# EAGLE design weather station - simple (EAGLE 9.0.1)
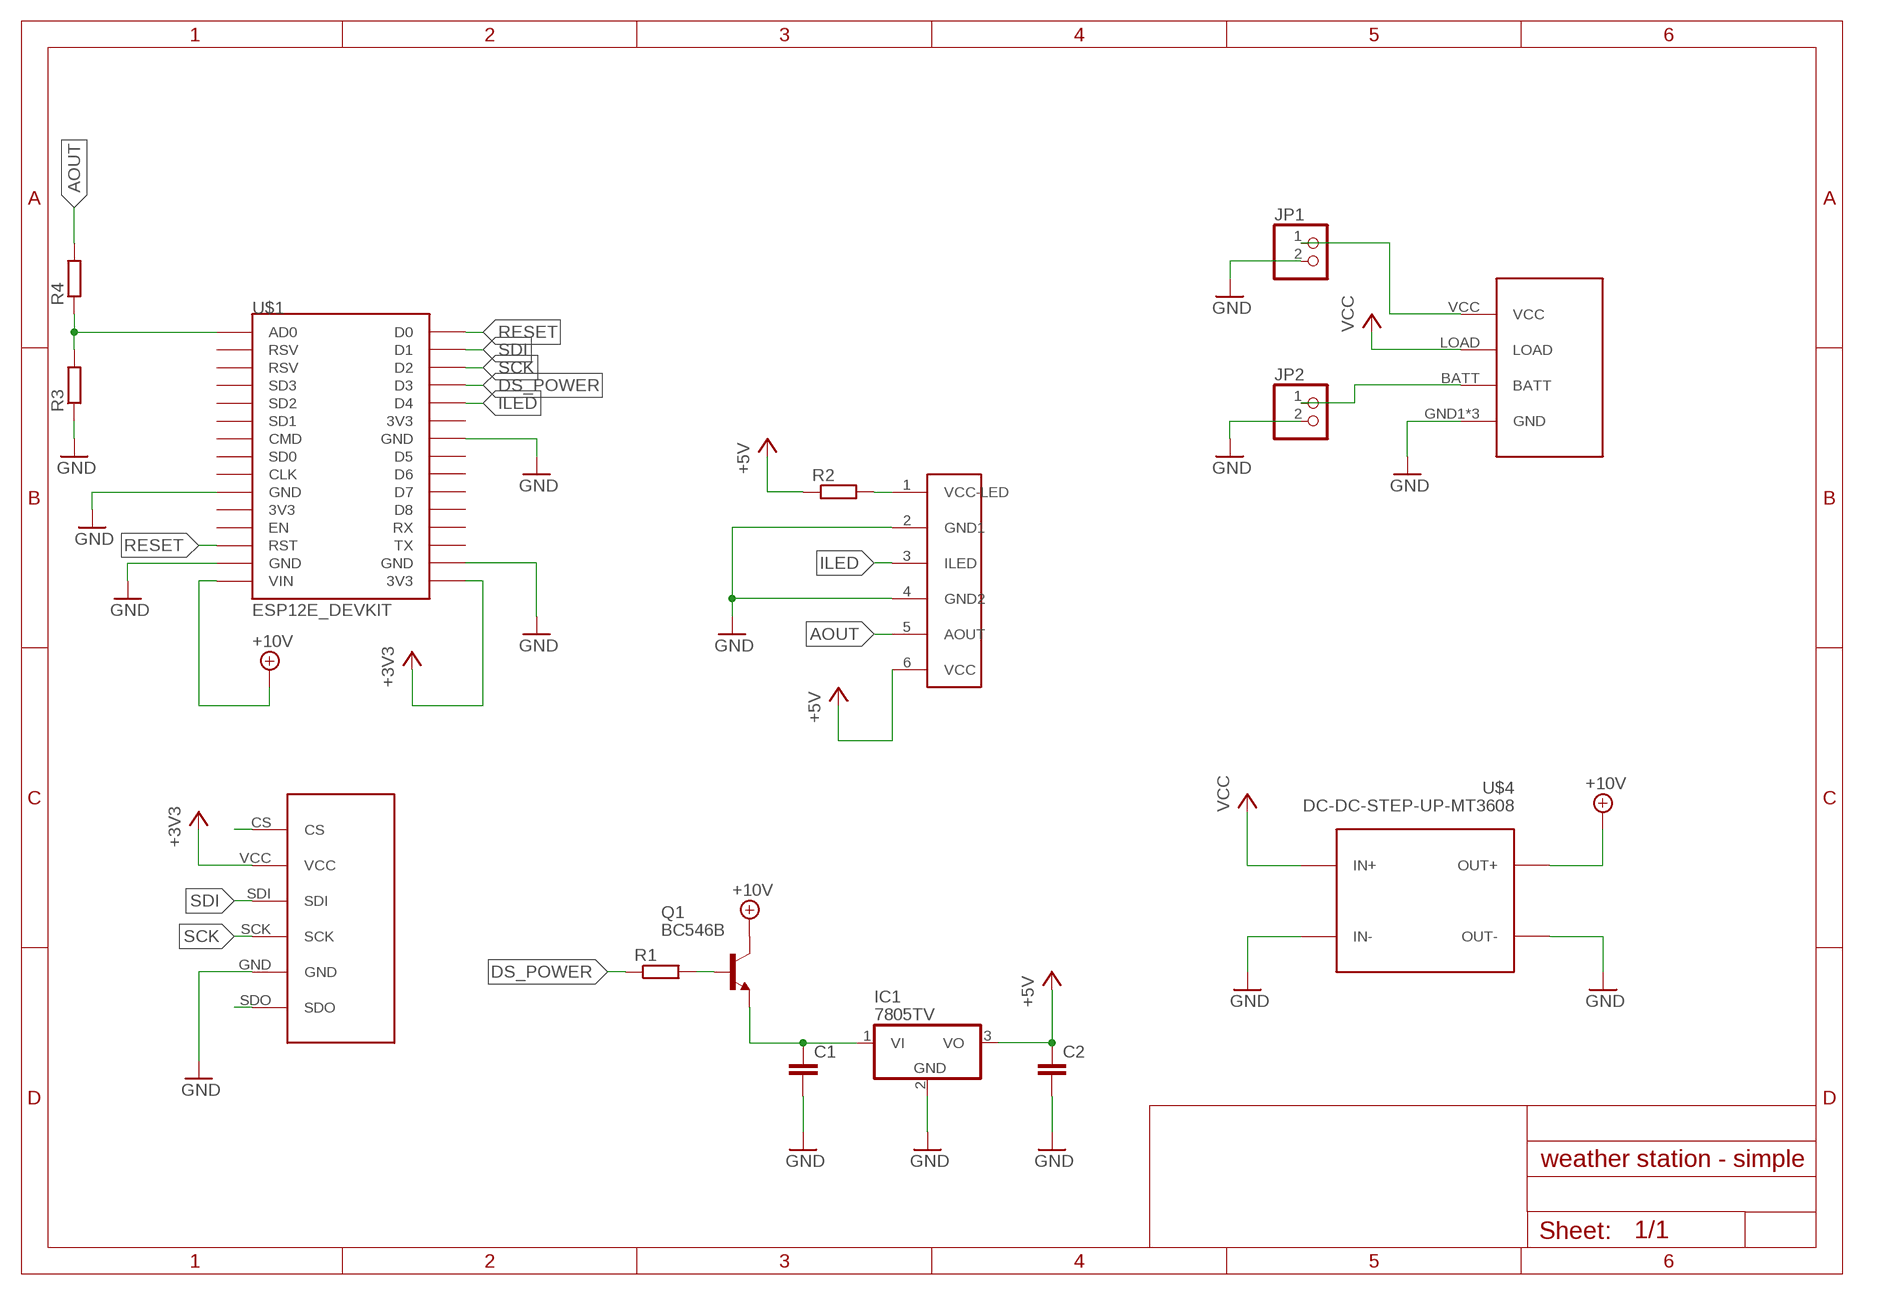
[diagram p0: schematic, sheet 1]

## Parts
C1  C-EU025-024X044  [C025-024X044]
C2  C-EU025-024X044  [C025-024X044]
IC1  7805TV  [TO220V]
JP1  PINHD-1X2  [1X02]
JP2  PINHD-1X2  [1X02]
Q1  BC546B  [TO92-EBC]
R1  R-EU_0207/10  [0207/10]
R2  R-EU_0207/10  [0207/10]
R3  R-EU_0207/10  [0207/10]
R4  R-EU_0207/10  [0207/10]
U$1  ESP12E_DEVKIT  [ESP12E_DEVKIT]
U$2  ADAFRUIT_SOLARCHARGER  [ADAFRUIT_SOLARCHARGER]
U$3  BME680_BLUEDOT  [1X06]
U$4  DC-DC-STEP-UP-MT3608  [DC-DC-STEP-UP-MT3608]
U$5  DUST_SENSOR  [DUST_SENSOR]

## Nets
+3V3: U$1.3V3@2(3V3) U$3.VCC
+5V: C2.1 IC1.3(VO) R2.1 U$5.6(VCC)
+10V: Q1.C U$1.VIN U$4.OUT+
AOUT: R4.2 U$5.5(AOUT)
DS_POWER: R1.1 U$1.D3
GND: C1.2 C2.2 IC1.2(GND) JP1.2 JP2.2 R3.1 U$1.GND@0(GND) U$1.GND@1(GND) U$1.GND@2(GND) U$1.GND@3(GND) U$2.GND1(GND) U$2.GND2(GND) U$2.GND3(GND) U$3.GND U$4.IN- U$4.OUT- U$5.2(GND1) U$5.4(GND2)
ILED: U$1.D4 U$5.3(ILED)
N$1: U$3.CS
N$2: JP2.1 U$2.BATT
N$3: JP1.1 U$2.VCC
N$4: C1.1 IC1.1(VI) Q1.E
N$5: Q1.B R1.2
N$6: R2.2 U$5.1(VCC-LED)
N$7: U$3.SDO
N$8: R3.2 R4.1 U$1.AD0
RESET: U$1.D0 U$1.RST
SCK: U$1.D2 U$3.SCK
SDI: U$1.D1 U$3.SDI
VCC: U$2.LOAD U$4.IN+
Unconnected: U$1.3V3@0(3V3) U$1.3V3@1(3V3) U$1.CLK U$1.CMD U$1.D5 U$1.D6 U$1.D7 U$1.D8 U$1.EN U$1.RSV@0(RSV) U$1.RSV@1(RSV) U$1.RX U$1.SD0 U$1.SD1 U$1.SD2 U$1.SD3 U$1.TX

## Library data of the parts
C1 C2 = rcl:C-EU: CAPACITOR, European symbol; SPICEPREFIX: C
IC1 = linear:78*: Positive VOLTAGE REGULATOR Source: http://cache.national.com/ds/LM/LM78L05.pdf http://www.fairchildsemi.com/ds/LM/LM7805.pdf
JP1 JP2 = pinhead:PINHD-1X2: PIN HEADER
Q1 = transistor-npn:BC546*: NPN Transistor
R1-R4 = rcl:R-EU_: RESISTOR, European symbol; SPICEPREFIX: R
U$1 = ESP12E_DEVKIT:ESP12E_DEVKIT: ESP12E DEVKIT BOARD
U$2 = ADAFRUIT-SOLARCHARGER:ADAFRUIT_SOLARCHARGER
U$3 = bme-680:BME680_BLUEDOT
U$4 = diy-modules:DC-DC-STEP-UP-MT3608: DC/DC Step-Up Regulator based on MT3608 chip MT3608 datasheet available here: https://www.olimex.com/Products/Breadboarding/BB-PWR-3608/resources/MT3608.pdf Click here to find device on ebay.com <http://www.ebay.com/sch/mt3608+module>
U$5 = dust-sensor:DUST_SENSOR

## Board
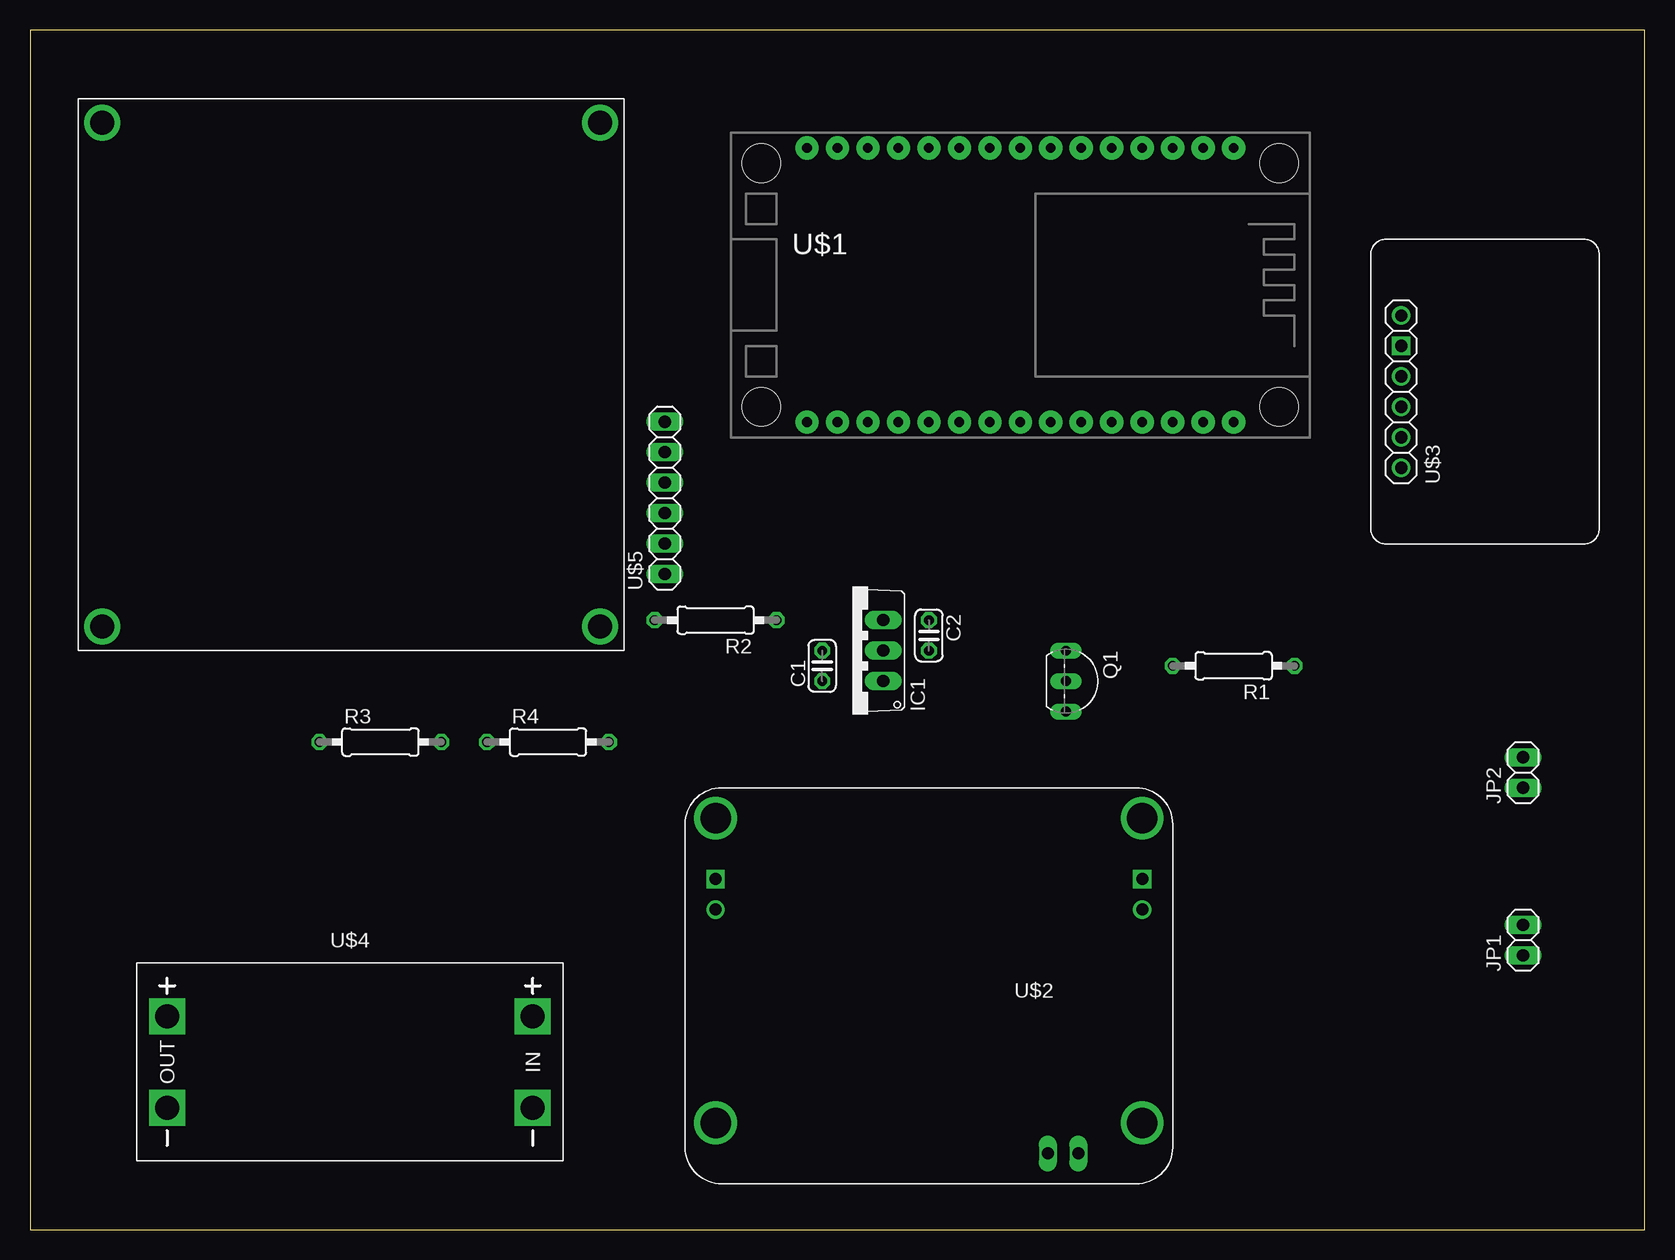
[diagram p1: board, top side]
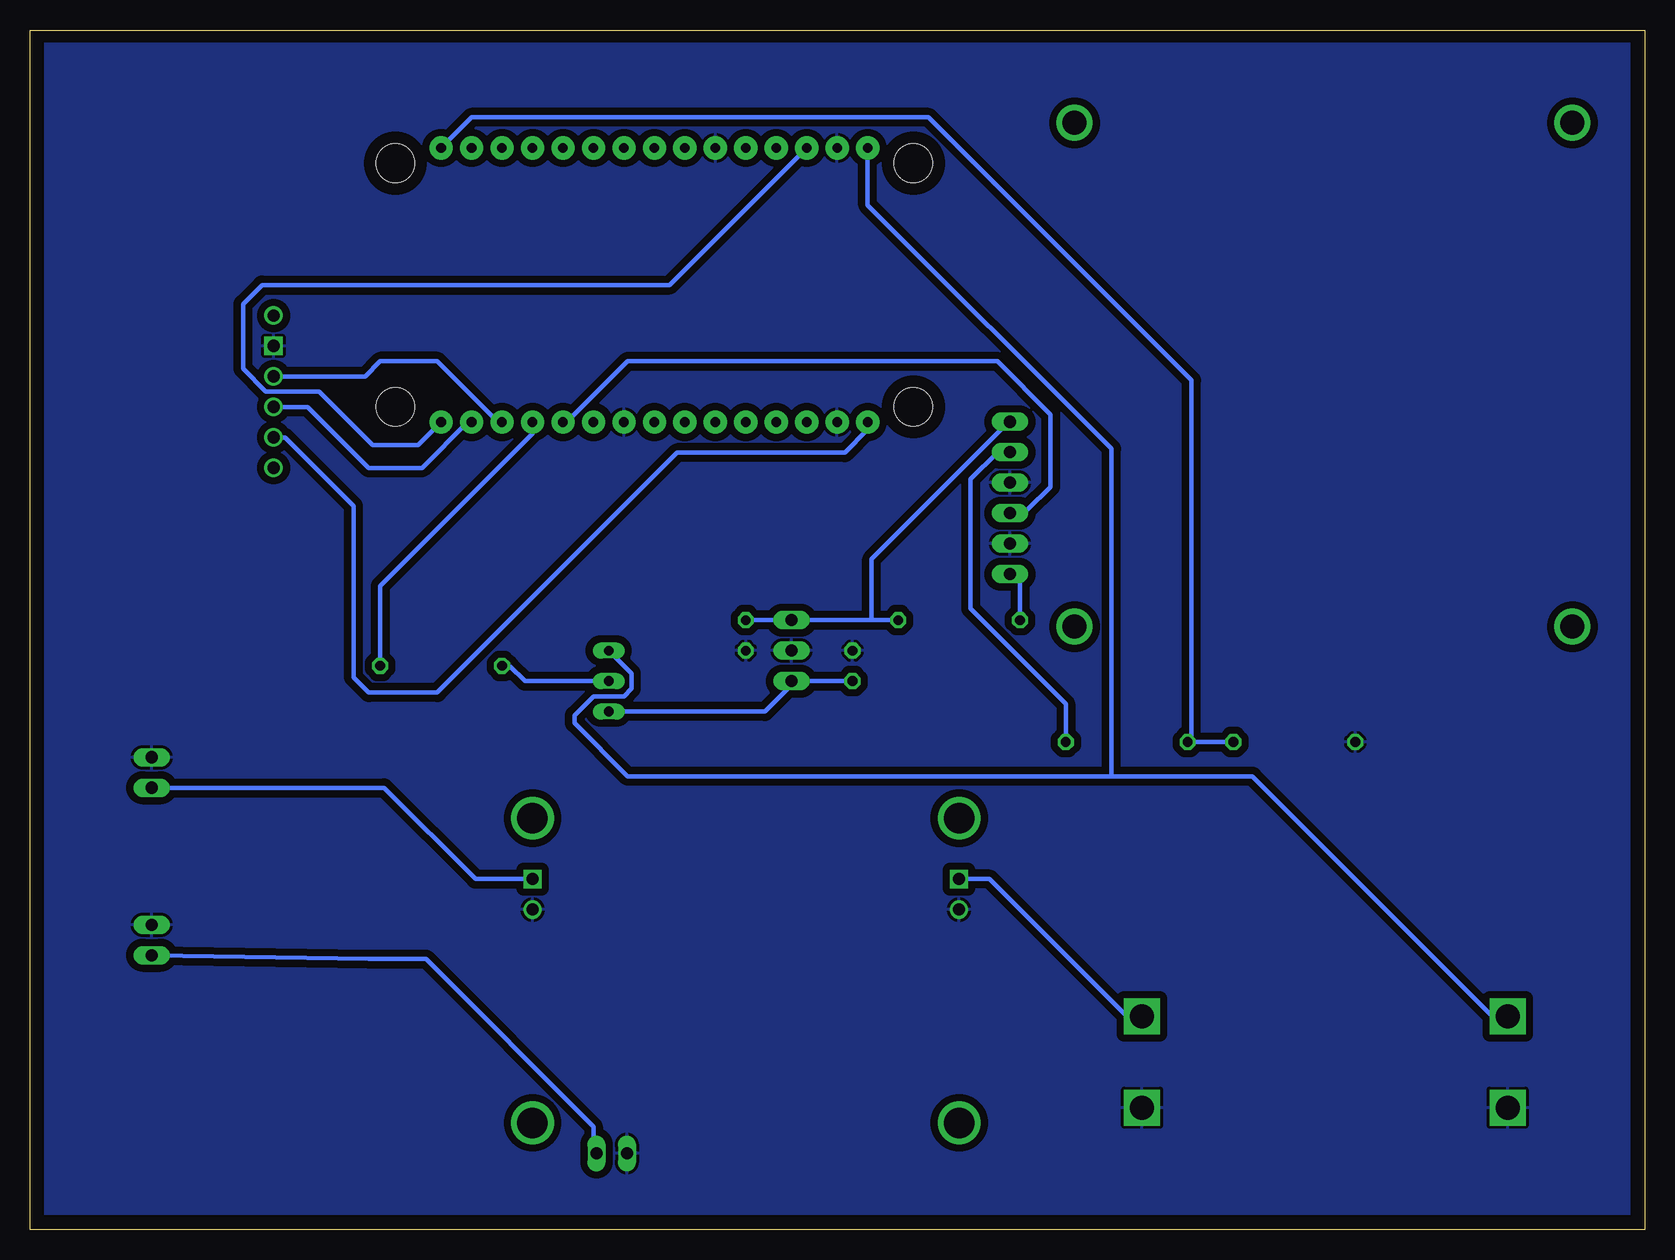
[diagram p2: board, bottom side, seen from below]

Size 134.6 x 100 mm. Coordinates in mm from the lower left corner, seen from the top.
Outline: 0,0 134.6,0 134.6,100 0,100 0,0
Copper layers (1*16): Top 0.035mm / dielectric 1.5mm / Bottom 0.035mm
Design rules "default *": minimum track width 15mil, minimum drill 0.35mm, track to track 10mil, track to pad 10mil, pad to pad 6mil, via to via 6mil, smd to smd 6mil, copper to edge 40mil, drill to drill 6mil, minimum pad ring 10mil, minimum via ring 8mil, stop-mask expansion 4mil, vias tented up to drill 0mil, thermal gap 10mil

### Footprints (pad centres in the part's own frame; a part is rotated, then mirrored left to right if it is on the bottom)
C025-024X044 = drill 0.813 octagon: 1 -1.27,0; 2 1.27,0
TO220V = drill 1.016 long: 1 -2.54,-2.54; 2 0,-2.54; 3 2.54,-2.54
1X02 = drill 1.016 long: 1 -1.27,0; 2 1.27,0
TO92-EBC = drill 0.813 long: B 0,-1.27; C -2.54,-1.27; E 2.54,-1.27
0207/10 = drill 0.813 octagon: 1 -5.08,0; 2 5.08,0
ESP12E_DEVKIT = drill 0.8 pad 1.93: 3V3@0 -11.43,-7.62; 3V3@1 11.43,5.08; 3V3@2 11.43,-17.78; AD0 -11.43,17.78; CLK -11.43,-2.54; CMD -11.43,2.54; D0 11.43,17.78; D1 11.43,15.24; D2 11.43,12.7; D3 11.43,10.16; D4 11.43,7.62; D5 11.43,0; D6 11.43,-2.54; D7 11.43,-5.08; D8 11.43,-7.62; EN -11.43,-10.16; GND@0 -11.43,-5.08; GND@1 -11.43,-15.24; GND@2 11.43,2.54; GND@3 11.43,-15.24; RST -11.43,-12.7; RSV@0 -11.43,15.24; RSV@1 -11.43,12.7; RX 11.43,-10.16; SD0 -11.43,0; SD1 -11.43,5.08; SD2 -11.43,7.62; SD3 -11.43,10.16; TX 11.43,-12.7; VIN -11.43,-17.78 | hole 3.2: -10.16,21.59; 10.16,21.59; 10.16,-21.59; -10.16,-21.59
ADAFRUIT_SOLARCHARGER = drill 1 square: BATT 2.54,7.62; LOAD 38.1,7.62 | drill 1: GND1 2.54,10.16; GND2 38.1,10.16 | drill 1 long: GND3 10.414,30.48; VCC 7.874,30.48 | drill 2.54: P$1 2.54,2.54; P$2 2.54,27.94; P$3 38.1,2.54; P$4 38.1,27.94
1X06 = drill 1.016: CS -6.35,0; SCK 1.27,0; SDI -1.27,0; SDO 6.35,0; VCC -3.81,0 | drill 1.016 square: GND 3.81,0
DC-DC-STEP-UP-MT3608 = drill 2 pad 2.8 square: IN+ 15.24,3.81; IN- 15.24,-3.81; OUT+ -15.24,3.81; OUT- -15.24,-3.81
DUST_SENSOR = drill 1.016 long: 1 6.38,-3.38; 2 8.92,-3.38; 3 11.46,-3.38; 4 14,-3.38; 5 16.54,-3.38; 6 19.08,-3.38 | drill 2: P$1 2,2; P$2 2,43.5; P$3 44,43.5; P$4 44,2

### Placement (x,y rotation side)
C1  66.04,46.99 90 top
C2  74.93,49.53 270 top
IC1  68.58,48.26 90 top
JP1  124.46,24.13 90 top
JP2  124.46,38.1 90 top
Q1  87.63,45.72 270 top
R1  100.33,46.99 180 top
R2  57.15,50.8 180 top
R3  29.21,40.64 0 top
R4  43.18,40.64 0 top
U$1  82.55,78.74 270 top
U$2  95.25,36.83 180 top
U$3  114.3,69.85 90 top
U$4  26.67,13.97 0 top
U$5  49.53,48.26 90 top

### Tracks (layer width: path | path; a pad name or v marks a point on that pad's centre or on a via)
+3V3
  Bottom 0.381: U$3.VCC 113.35,66.04 107.63,60.33 107.63,46.04 106.36,44.77 100.65,44.77 80.64,64.77 66.67,64.77 64.77,66.67 U$1.3V3@2
+5V
  Bottom 0.381: 64.45,50.8 IC1.3 C2.1 | 64.45,50.8 R2.1 | 64.45,50.8 64.45,55.88 53.02,67.31 U$5.6
+10V
  Bottom 0.381: Q1.C 84.45,46.35 84.45,45.09 85.09,44.45 87.63,44.45 89.22,42.86 89.22,42.23 84.77,37.78 44.45,37.78 | 44.45,37.78 32.7,37.78 12.7,17.78 U$4.OUT+ | U$1.VIN 64.77,85.41 44.45,65.09 44.45,37.78
AOUT
  Bottom 0.381: R4.2 48.26,43.81 56.2,51.75 56.2,62.55 53.98,64.77 53.02,64.77 U$5.5
DS_POWER
  Bottom 0.381: R1.1 105.41,53.66 92.71,66.36 U$1.D3
GND
  pour Bottom (isolate 0.61): 1.27,1.27 133.35,1.27 133.35,99.06 1.27,99.06
ILED
  Bottom 0.381: U$1.D4 89.85,67.31 84.77,72.39 53.98,72.39 49.53,67.94 49.53,61.91 51.44,60.01 52.7,60.01 U$5.3
N$2
  Bottom 0.381: U$2.BATT 97.47,29.21 105.09,36.83 JP2.1
N$3
  Bottom 0.381: JP1.1 106.36,22.54 101.6,22.54 87.63,8.57 87.63,6.35 U$2.VCC
N$4
  Bottom 0.381: 70.8,45.72 C1.1 | Q1.E 73.34,43.18 70.8,45.72 | 70.8,45.72 IC1.1
N$5
  Bottom 0.381: Q1.B 93.34,45.72 94.61,46.99 R1.2
N$6
  Bottom 0.381: R2.2 52.07,53.98 52.7,54.61 U$5.1
N$8
  Bottom 0.381: 37.78,40.64 R3.2 | U$1.AD0 97.79,92.71 59.69,92.71 37.78,70.8 37.78,40.64 | 37.78,40.64 R4.1
RESET
  Bottom 0.381: U$1.RST 81.28,78.74 115.25,78.74 116.84,77.15 116.84,71.75 114.94,69.85 110.49,69.85 106.05,65.41 102.23,65.41 U$1.D0
SCK
  Bottom 0.381: U$3.SCK 106.68,71.12 105.41,72.39 100.65,72.39 95.57,67.31 U$1.D2
SDI
  Bottom 0.381: U$3.SDI 111.44,68.58 106.36,63.5 101.92,63.5 98.11,67.31 U$1.D1
VCC
  Bottom 0.381: U$2.LOAD 54.61,29.21 43.18,17.78 U$4.IN+